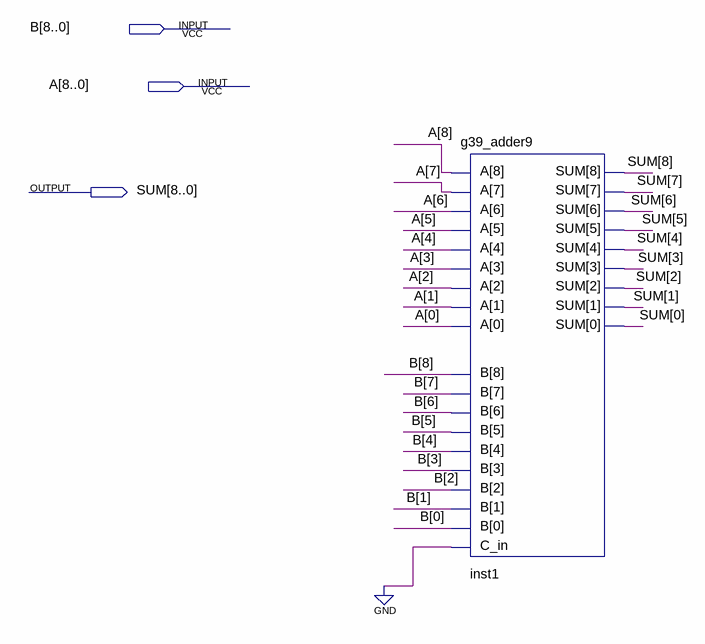
[diagram p0: schematic sheet]
// Quartus schematic g39_fulladder9.bdf as structural Verilog: 1 symbols, 3 pins
module g39_fulladder9 (
  input  [8:0] B,
  input  [8:0] A,
  output [8:0] SUM
);

  g39_adder9 inst1 (.C_in(1'b0), .A(A), .B(B), .SUM(SUM));
endmodule
